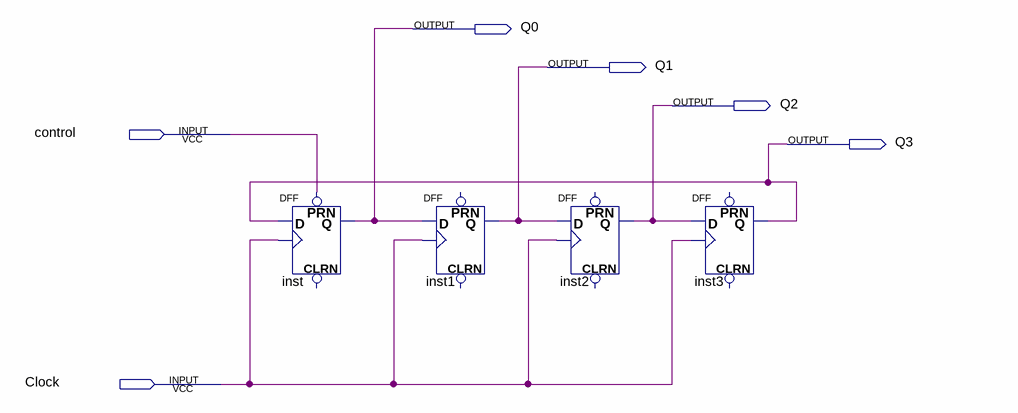
[diagram p0: schematic sheet]
// Quartus schematic contadorEmAnel.bdf as structural Verilog: 4 symbols, 6 pins
module contadorEmAnel (
  input  control,
  input  Clock,
  output Q0,
  output Q1,
  output Q2,
  output Q3
);

  DFF inst (.CLK(Clock), .D(Q3), .PRN(control), .Q(Q0));  // open: CLRN
  DFF inst1 (.CLK(Clock), .D(Q0), .Q(Q1));  // open: CLRN, PRN
  DFF inst2 (.CLK(Clock), .D(Q1), .Q(Q2));  // open: CLRN, PRN
  DFF inst3 (.CLK(Clock), .D(Q2), .Q(Q3));  // open: CLRN, PRN
endmodule
